# EAGLE design MYC_Homematic_FS20 (EAGLE 7.3.0)
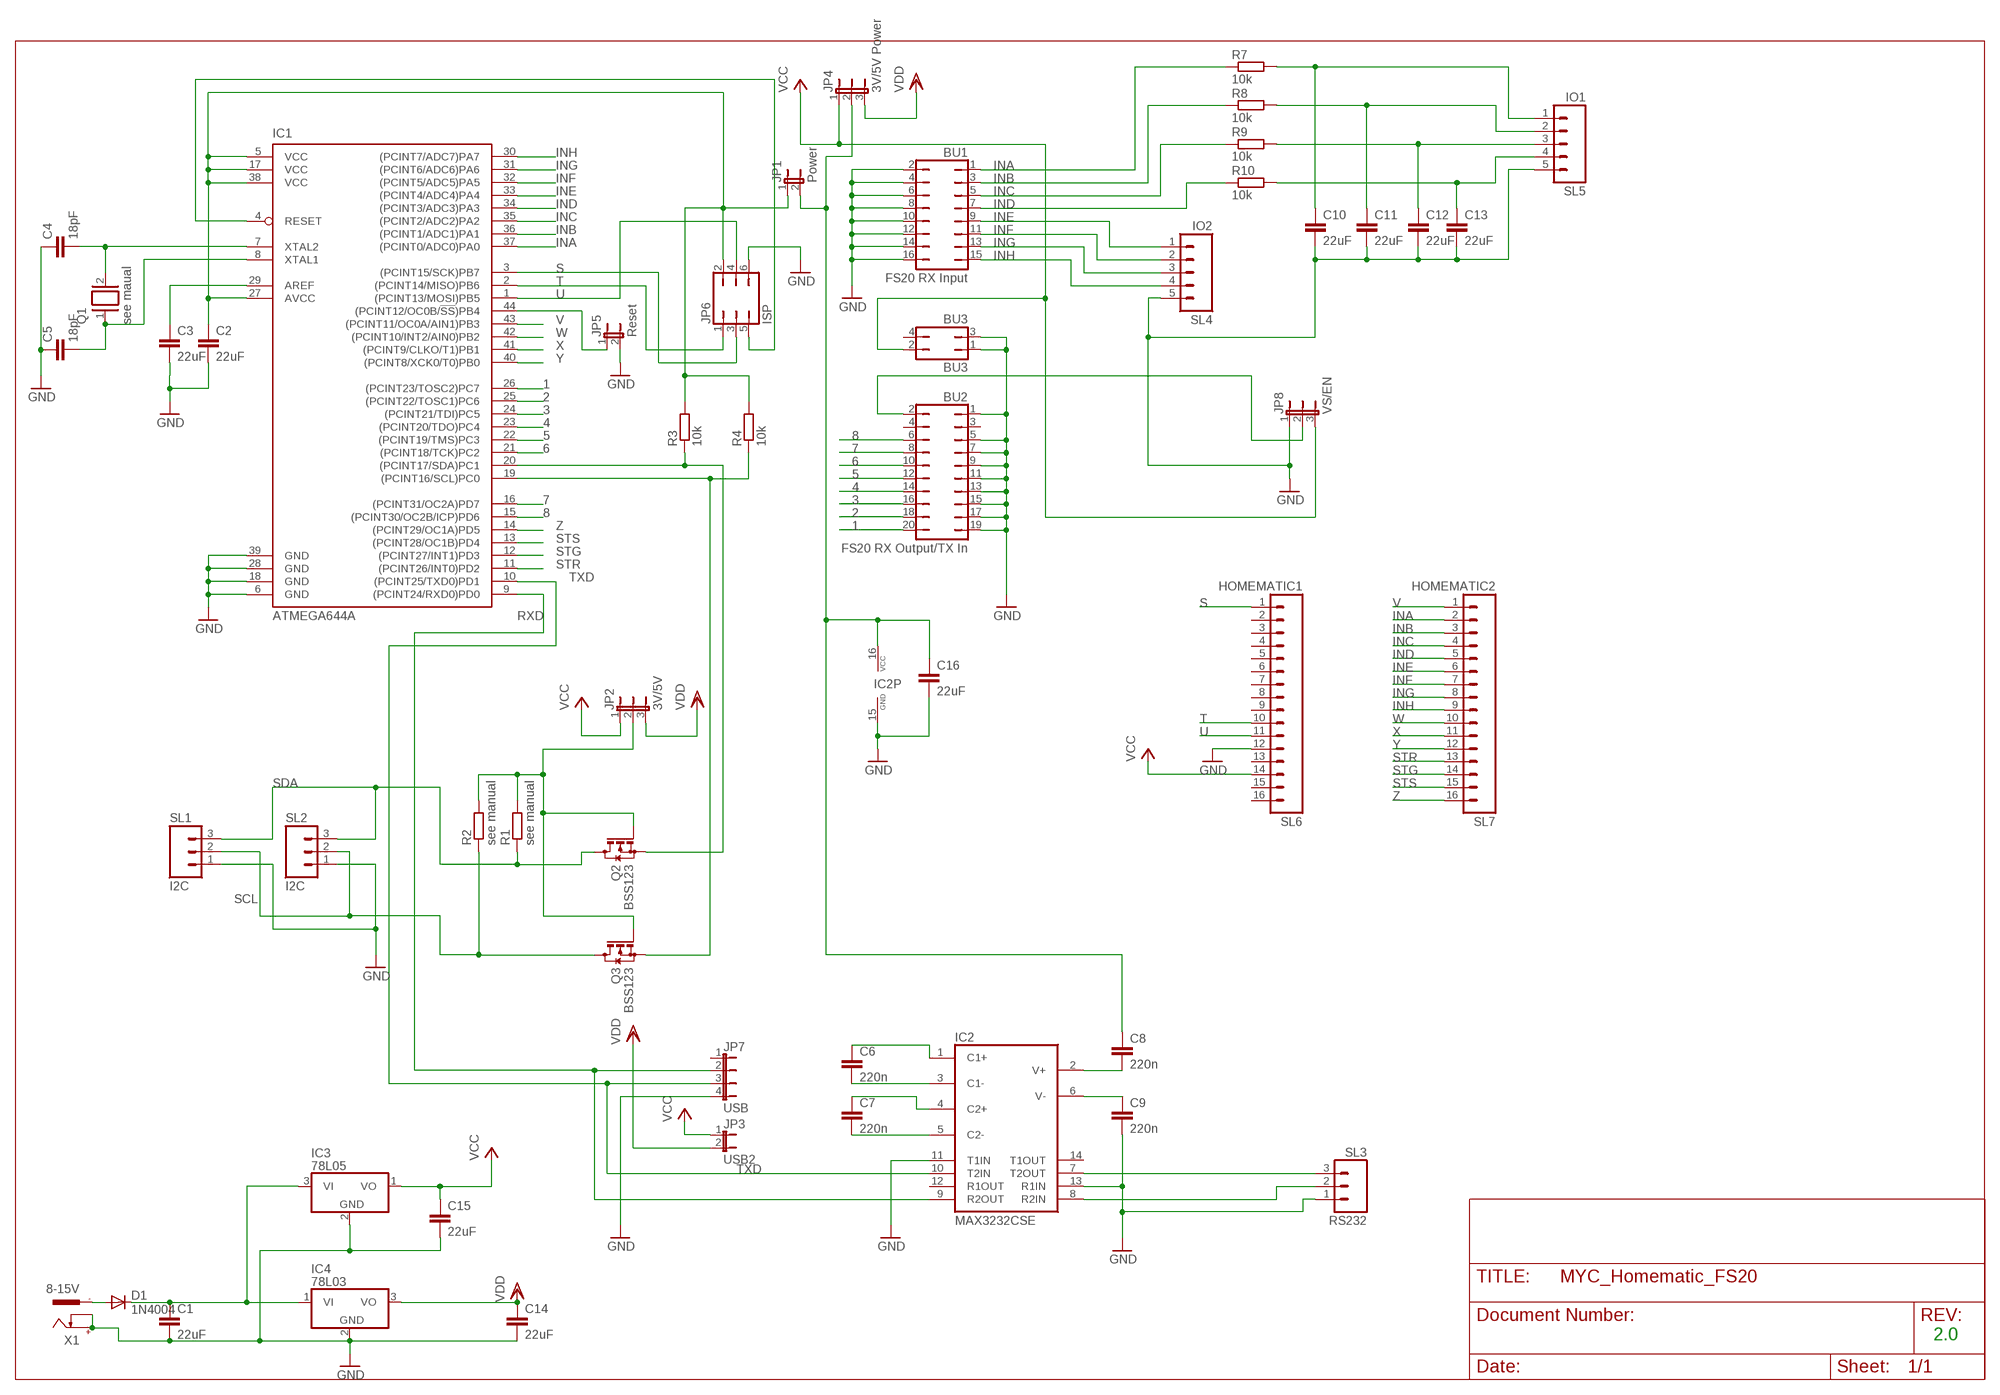
[diagram p0: schematic, sheet 1]

## Parts
BU1  FS20 RX Input  JP8Q  [JP8Q]
BU2  FS20 RX Output/TX In  JP10Q  [JP10Q]
BU3  BU3  JP2Q  [JP2Q]
C1  22uF  C-EUC1206  [C1206]
C2  22uF  C-EUC1206  [C1206]
C3  22uF  C-EUC1206  [C1206]
C4  18pF  C-EU025-030X050  [C025-030X050]
C5  18pF  C-EU025-030X050  [C025-030X050]
C6  220n  C-EUC1206  [C1206]
C7  220n  C-EUC1206  [C1206]
C8  220n  C-EUC1206  [C1206]
C9  220n  C-EUC1206  [C1206]
C10  22uF  C-EUC1206  [C1206]
C11  22uF  C-EUC1206  [C1206]
C12  22uF  C-EUC1206  [C1206]
C13  22uF  C-EUC1206  [C1206]
C14  22uF  C-EUC1206  [C1206]
C15  22uF  C-EUC1206  [C1206]
C16  22uF  C-EUC1206  [C1206]
D1  1N4004  [DO41-10]
IC1  ATMEGA644A  [TQFP44]
IC2  MAX3232CSE  [SO16]
IC3  78L05  7805L  [TO92]
IC4  78L03  7805TV  [TO220V]
JP1  Power  JP1E  [JP1]
JP2  3V/5V  JP2E  [JP2]
JP3  USB2  JP1E  [JP1]
JP4  3V/5V Power  JP2E  [JP2]
JP5  Reset  JP1E  [JP1]
JP6  ISP  JP3Q  [JP3Q]
JP7  USB  JP4E  [JP4]
JP8  VS/EN  JP2E  [JP2]
Q1  see maual  XTAL/S  [QS]
Q2  BSS123  [SOT23]
Q3  BSS123  [SOT23]
R1  see manual  R-EU_R1206  [R1206]
R2  see manual  R-EU_R1206  [R1206]
R3  10k  R-EU_R1206  [R1206]
R4  10k  R-EU_R1206  [R1206]
R7  10k  R-EU_R1206  [R1206]
R8  10k  R-EU_R1206  [R1206]
R9  10k  R-EU_R1206  [R1206]
R10  10k  R-EU_R1206  [R1206]
SL1  I2C  M03  [03P]
SL2  I2C  M03  [03P]
SL3  RS232  M03  [03P]
SL4  IO2  M05  [05P]
SL5  IO1  M05  [05P]
SL6  HOMEMATIC1  M16  [16P]
SL7  HOMEMATIC2  M16  [16P]
X1  8-15V  737992-55  [737992-5]

## Nets
1: BU2.20 IC1.26((PCINT23/TOSC2)PC7)
2: BU2.18 IC1.25((PCINT22/TOSC1)PC6)
3: BU2.16 IC1.24((PCINT21/TDI)PC5)
4: BU2.14 IC1.23((PCINT20/TDO)PC4)
5: BU2.12 IC1.22((PCINT19/TMS)PC3)
6: BU2.10 IC1.21((PCINT18/TCK)PC2)
7: BU2.8 IC1.16((PCINT31/OC2A)PD7)
8: BU2.6 IC1.15((PCINT30/OC2B/ICP)PD6)
C13: C6.1 IC2.1(C1+)
GND: BU1.2 BU1.4 BU1.6 BU1.8 BU1.10 BU1.12 BU1.14 BU1.16 BU2.1 BU2.5 BU2.7 BU2.9 BU2.11 BU2.13 BU2.15 BU2.17 BU2.19 BU3.1 BU3.3 C1.2 C2.2 C3.2 C4.1 C5.1 C9.2 C10.2 C11.2 C12.2 C13.2 C14.2 C15.2 C16.2 IC1.6(GND) IC1.18(GND) IC1.28(GND) IC1.39(GND) IC2.11(T1IN) IC2.13(R1IN) IC2.15(GND) IC3.2(GND) IC4.2(GND) JP5.2 JP6.6 JP7.4 JP8.1 SL1.1 SL2.1 SL3.1 SL4.5 SL5.5 SL6.12 X1.+ X1.K
INA: BU1.1 IC1.37((PCINT0/ADC0)PA0) R7.1 SL7.2
INB: BU1.3 IC1.36((PCINT1/ADC1)PA1) R8.1 SL7.3
INC: BU1.5 IC1.35((PCINT2/ADC2)PA2) R9.1 SL7.4
IND: BU1.7 IC1.34((PCINT3/ADC3)PA3) R10.1 SL7.5
INE: BU1.9 IC1.33((PCINT4/ADC4)PA4) SL4.1 SL7.6
INF: BU1.11 IC1.32((PCINT5/ADC5)PA5) SL4.2 SL7.7
ING: BU1.13 IC1.31((PCINT6/ADC6)PA6) SL4.3 SL7.8
INH: BU1.15 IC1.30((PCINT7/ADC7)PA7) SL4.4 SL7.9
N$1: C1.1 D1.C IC3.3(VI) IC4.1(VI)
N$2: IC1.44((PCINT12/OC0B/!SS!)PB4) JP5.1
N$3: C7.2 IC2.5(C2-)
N$4: JP2.2 Q2.1(G) Q3.1(G) R1.2 R2.2
N$5: IC1.19((PCINT16/SCL)PC0) Q3.2(S) R4.1
N$6: C3.1 IC1.29(AREF)
N$7: C2.1 IC1.5(VCC) IC1.17(VCC) IC1.27(AVCC) IC1.38(VCC) JP1.1 JP6.2 R3.2 R4.2
N$8: IC1.20((PCINT17/SDA)PC1) Q2.2(S) R3.1
N$9: BU2.2 JP8.2
N$10: D1.A X1.-1
N$11: IC2.8(R2IN) SL3.2
N$13: C7.1 IC2.4(C2+)
N$14: C6.2 IC2.3(C1-)
N$15: C10.1 R7.2 SL5.1
N$16: C8.2 IC2.2(V+)
N$17: C9.1 IC2.6(V-)
N$18: C11.1 R8.2 SL5.2
N$19: C4.2 IC1.7(XTAL2) Q1.2
N$21: C12.1 R9.2 SL5.3
N$22: C13.1 R10.2 SL5.4
N$23: C8.1 C16.1 IC2.16(VCC) JP1.2 JP4.2
N$24: IC1.4(RESET) JP6.5
N$27: IC2.7(T2OUT) SL3.3
N$37: C5.2 IC1.8(XTAL1) Q1.1
RXD: IC1.9((PCINT24/RXD0)PD0) IC2.9(R2OUT) JP7.2
S: IC1.3((PCINT15/SCK)PB7) JP6.3 SL6.1
SCL: Q3.3(D) R2.1 SL1.2 SL2.2
SDA: Q2.3(D) R1.1 SL1.3 SL2.3
STG: IC1.12((PCINT27/INT1)PD3) SL7.14
STR: IC1.11((PCINT26/INT0)PD2) SL7.13
STS: IC1.13((PCINT28/OC1B)PD4) SL7.15
T: IC1.2((PCINT14/MISO)PB6) JP6.1 SL6.10
TXD: IC1.10((PCINT25/TXD0)PD1) IC2.10(T2IN) JP7.3
U: IC1.1((PCINT13/MOSI)PB5) JP6.4 SL6.11
V: IC1.43((PCINT11/OC0A/AIN1)PB3) SL7.1
VCC: BU3.2 C15.1 IC3.1(VO) JP2.1 JP3.1 JP4.1 JP8.3 SL6.14
VDD: C14.1 IC4.3(VO) JP2.3 JP3.2 JP4.3
W: IC1.42((PCINT10/INT2/AIN0)PB2) SL7.10
X: IC1.41((PCINT9/CLKO/T1)PB1) SL7.11
Y: IC1.40((PCINT8/XCK0/T0)PB0) SL7.12
Z: IC1.14((PCINT29/OC1A)PD5) SL7.16
Unconnected: BU2.3 BU2.4 BU3.4 IC2.12(R1OUT) IC2.14(T1OUT) JP7.1 SL6.2 SL6.3 SL6.4 SL6.5 SL6.6 SL6.7 SL6.8 SL6.9 SL6.13 SL6.15 SL6.16 X1.-2

## Notes on the sheet
- 2.0

## Library data of the parts
BU1 = jumper:JP8Q: JUMPER
BU2 = jumper:JP10Q: JUMPER
BU3 = jumper:JP2Q: JUMPER
C1-C16 = resistor:C-EU: CAPACITOR, European symbol
D1 = diode:1N4004: DIODE general purpose rectifier, 1 A
IC1 = atmel:ATMEGA644: 8-bit Microcontroller with 64K Bytes In-System Programmable Flash Source: http://www.atmel.com/dyn/resources/prod_documents/doc2593.pdf; MPN: ATMEGA644PV-10AU; OC_FARNELL: 1455123; OC_NEWARK: 58M3748
IC2 = maxim:MAX3232*: True RS-232 Transceivers 3.0V to 5.5V, Low-Power up to 1Mbps, Using Four 0.1µF External Capacitors Source: http://pdfserv.maxim-ic.com/en/ds/MAX3222-MAX3241.pdf; MPN: MAX3232CSE; OC_FARNELL: 9725490; OC_NEWARK: 90C2890
IC3 IC4 = linear:78*: Positive VOLTAGE REGULATOR Source: http://cache.national.com/ds/LM/LM78L05.pdf http://www.fairchildsemi.com/ds/LM/LM7805.pdf
JP1 JP3 JP5 = jumper:JP1E: JUMPER
JP2 JP4 JP8 = jumper:JP2E: JUMPER
JP6 = jumper:JP3Q: JUMPER
JP7 = jumper:JP4E: JUMPER
Q1 = special:XTAL/S: CRYSTAL
Q2 Q3 = transistor-small-signal:BSS123: N-CHANNEL MOS FET
R1-R4 R7-R10 = resistor:R-EU_: RESISTOR, European symbol
SL1-SL3 = con-amp-quick:M03: AMP QUICK CONNECTOR; OC_FARNELL: unknown; OC_NEWARK: unknown
SL4 SL5 = con-amp-quick:M05: AMP QUICK CONNECTOR; OC_FARNELL: unknown; OC_NEWARK: unknown
SL6 SL7 = con-amp-quick:M16: AMP QUICK CONNECTOR; OC_FARNELL: unknown; OC_NEWARK: unknown
X1 = con-conrad:737992-55: FEMALE PRINT CONNECTOR DIN 45323 (34V/3A), ROKA, distributor Conrad

## Board
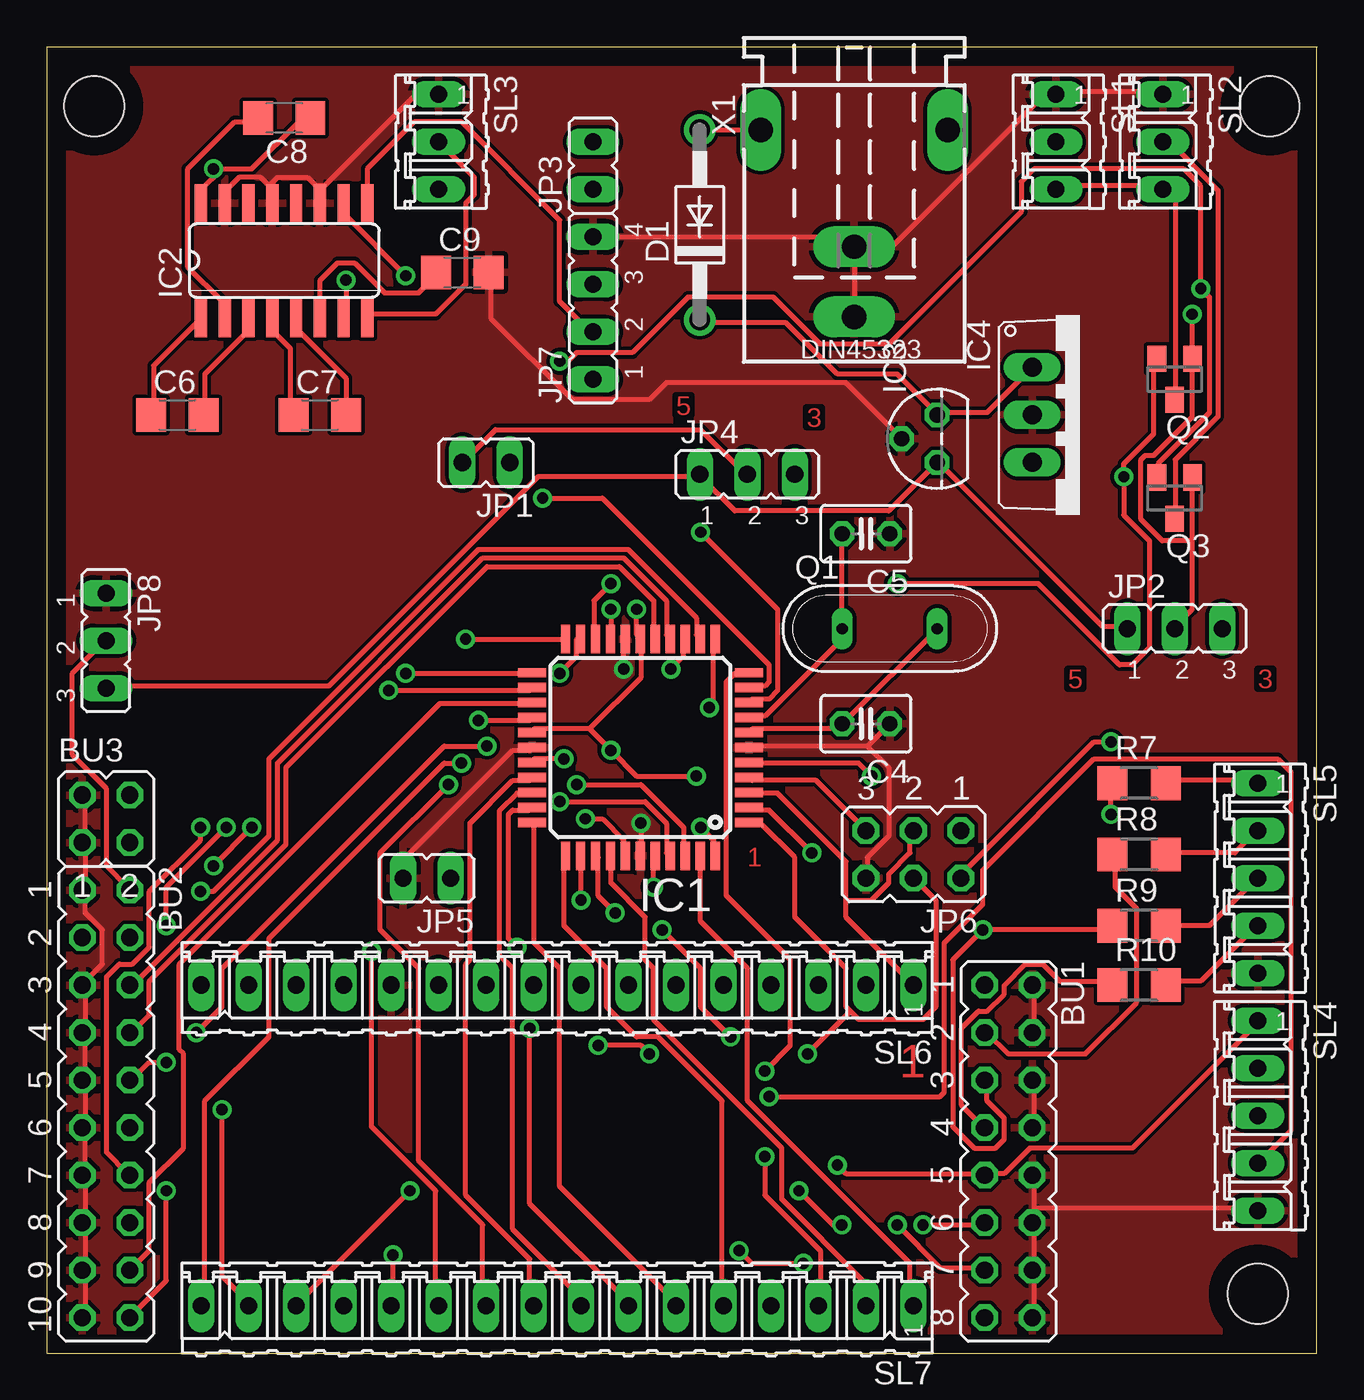
[diagram p1: board, top side]
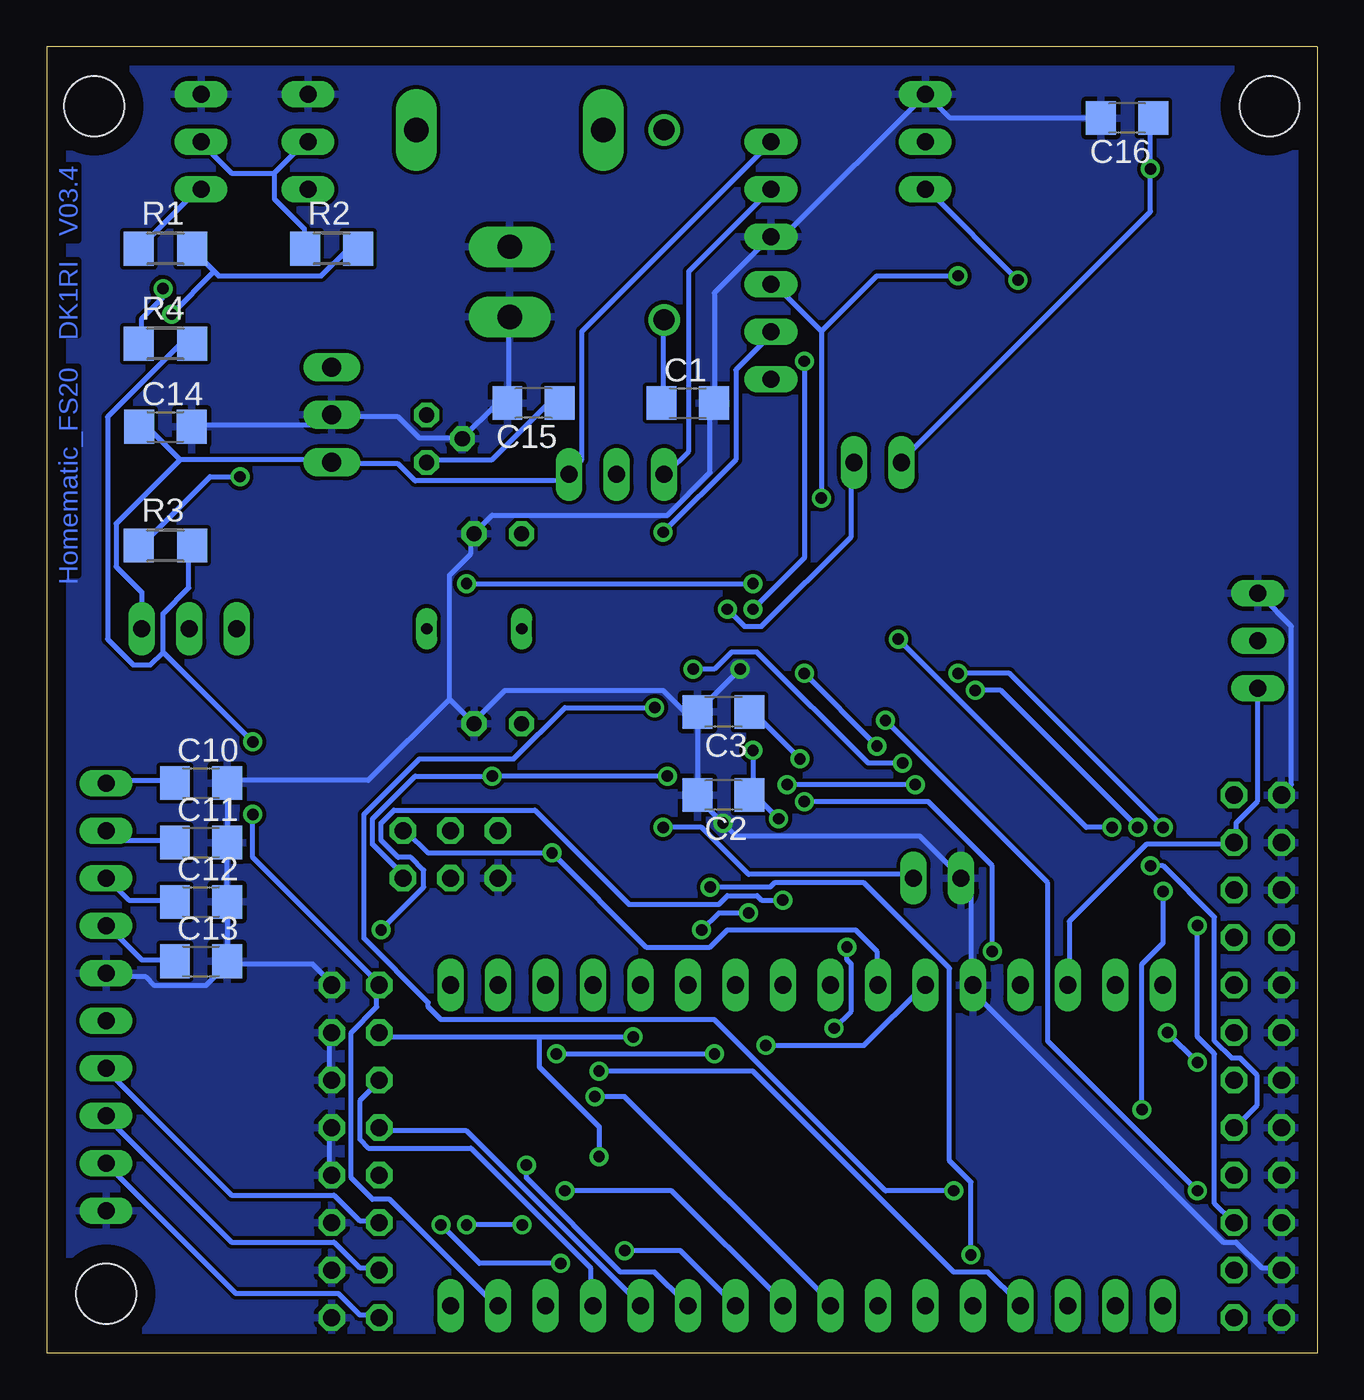
[diagram p2: board, bottom side, seen from below]

Size 67.94 x 69.85 mm. Coordinates in mm from the lower left corner, seen from the top.
Outline: 67.92,69.84 67.92,0 0,0 0,69.85 67.94,69.85
Copper layers (1*16): Top 0.035mm / dielectric 1.5mm / Bottom 0.035mm
Design rules "default": minimum track width 10mil, minimum drill 24mil, track to track 8mil, track to pad 8mil, pad to pad 8mil, via to via 8mil, smd to smd 8mil, copper to edge 40mil, drill to drill 8mil, minimum pad ring 10mil, minimum via ring 8mil, stop-mask expansion 4mil, vias tented up to drill 0mil, thermal gap 10mil
Holes 3.2 mm at 65.41,66.67 64.77,3.17 2.54,66.67

### Footprints (pad centres in the part's own frame; a part is rotated, then mirrored left to right if it is on the bottom)
JP8Q = drill 0.914 octagon: 1 -8.89,-1.27; 2 -8.89,1.27; 3 -6.35,-1.27; 4 -6.35,1.27; 5 -3.81,-1.27; 6 -3.81,1.27; 7 -1.27,-1.27; 8 -1.27,1.27; 9 1.27,-1.27; 10 1.27,1.27; 11 3.81,-1.27; 12 3.81,1.27; 13 6.35,-1.27; 14 6.35,1.27; 15 8.89,-1.27; 16 8.89,1.27
JP10Q = drill 0.914 octagon: 1 -11.43,-1.27; 2 -11.43,1.27; 3 -8.89,-1.27; 4 -8.89,1.27; 5 -6.35,-1.27; 6 -6.35,1.27; 7 -3.81,-1.27; 8 -3.81,1.27; 9 -1.27,-1.27; 10 -1.27,1.27; 11 1.27,-1.27; 12 1.27,1.27; 13 3.81,-1.27; 14 3.81,1.27; 15 6.35,-1.27; 16 6.35,1.27; 17 8.89,-1.27; 18 8.89,1.27; 19 11.43,-1.27; 20 11.43,1.27
JP2Q = drill 0.914 octagon: 1 -1.27,-1.27; 2 1.27,-1.27; 3 -1.27,1.27; 4 1.27,1.27
C1206 = smd 1.6 x 1.8: 1 -1.4,0; 2 1.4,0
C025-030X050 = drill 0.813 octagon: 1 -1.27,0; 2 1.27,0
DO41-10 = drill 1.118: A 5.08,0; C -5.08,0
TQFP44 = smd 1.5 x 0.5: 1 -5.8,4; 2 -5.8,3.2; 3 -5.8,2.4; 4 -5.8,1.6; 5 -5.8,0.8; 6 -5.8,0; 7 -5.8,-0.8; 8 -5.8,-1.6; 9 -5.8,-2.4; 10 -5.8,-3.2; 11 -5.8,-4; 23 5.8,-4; 24 5.8,-3.2; 25 5.8,-2.4; 26 5.8,-1.6; 27 5.8,-0.8; 28 5.8,0; 29 5.8,0.8; 30 5.8,1.6; 31 5.8,2.4; 32 5.8,3.2; 33 5.8,4 | smd 0.5 x 1.5: 12 -4,-5.8; 13 -3.2,-5.8; 14 -2.4,-5.8; 15 -1.6,-5.8; 16 -0.8,-5.8; 17 0,-5.8; 18 0.8,-5.8; 19 1.6,-5.8; 20 2.4,-5.8; 21 3.2,-5.8; 22 4,-5.8; 34 4,5.8; 35 3.2,5.8; 36 2.4,5.8; 37 1.6,5.8; 38 0.8,5.8; 39 0,5.8; 40 -0.8,5.8; 41 -1.6,5.8; 42 -2.4,5.8; 43 -3.2,5.8; 44 -4,5.8
SO16 = smd 0.66 x 2.032: 1 -4.445,-3.073; 2 -3.175,-3.073; 3 -1.905,-3.073; 4 -0.635,-3.073; 5 0.635,-3.073; 6 1.905,-3.073; 7 3.175,-3.073; 8 4.445,-3.073; 9 4.445,3.073; 10 3.175,3.073; 11 1.905,3.073; 12 0.635,3.073; 13 -0.635,3.073; 14 -1.905,3.073; 15 -3.175,3.073; 16 -4.445,3.073
TO92 = drill 0.813 octagon: 1 -1.27,0; 2 0,1.905; 3 1.27,0
TO220V = drill 1.016 long: 1 -2.54,-2.54; 2 0,-2.54; 3 2.54,-2.54
JP1 = drill 0.914 long: 1 0,-1.27; 2 0,1.27
JP2 = drill 0.914 long: 1 -2.54,0; 2 0,0; 3 2.54,0
JP3Q = drill 0.914 octagon: 1 -2.54,-1.27; 2 -2.54,1.27; 3 0,-1.27; 4 0,1.27; 5 2.54,-1.27; 6 2.54,1.27
JP4 = drill 0.914 long: 1 -3.81,0; 2 -1.27,0; 3 1.27,0; 4 3.81,0
QS = drill 0.61 long: 1 -2.54,0; 2 2.54,0
SOT23 = smd 1 x 1.4: 1 -0.95,-1.1; 2 0.95,-1.1; 3 0,1.1
R1206 = smd 1.6 x 1.803: 1 -1.422,0; 2 1.422,0
03P = drill 0.914 long: 1 -2.54,0; 2 0,0; 3 2.54,0
05P = drill 0.914 long: 1 -5.08,0; 2 -2.54,0; 3 0,0; 4 2.54,0; 5 5.08,0
16P = drill 0.914 long: 1 -19.05,0; 2 -16.51,0; 3 -13.97,0; 4 -11.43,0; 5 -8.89,0; 6 -6.35,0; 7 -3.81,0; 8 -1.27,0; 9 1.27,0; 10 3.81,0; 11 6.35,0; 12 8.89,0; 13 11.43,0; 14 13.97,0; 15 16.51,0; 16 19.05,0
737992-5 = drill 1.3 pad 2.184 long: + 0,10; -1 5,0; -2 -5,0; K 0,6.25

### Placement (x,y rotation side)
BU1  51.44,10.79 270 top
BU2  3.17,13.34 270 top
BU3  3.17,28.57 0 top
C1  33.66,50.8 0 bottom
C2  31.75,29.84 180 bottom
C3  31.75,34.29 180 bottom
C4  43.81,33.66 180 top
C5  43.81,43.81 180 top
C6  6.99,50.16 0 top
C7  14.61,50.16 0 top
C8  12.7,66.04 180 top
C9  22.23,57.78 0 top
C10  59.69,30.48 0 bottom
C11  59.69,27.3 0 bottom
C12  59.69,24.13 0 bottom
C13  59.69,20.95 0 bottom
C14  61.59,49.53 0 bottom
C15  41.91,50.8 180 bottom
C16  10.16,66.04 180 bottom
D1  34.92,60.33 90 top
IC1  31.75,32.38 180 top
IC2  12.7,58.42 0 top
IC3  47.62,48.9 90 top
IC4  55.24,50.16 270 top
JP1  23.5,47.62 90 top
JP2  60.33,38.73 0 top
JP3  29.21,63.5 0 top
JP4  37.47,46.99 0 top
JP5  20.32,25.4 90 top
JP6  46.35,26.67 180 top
JP7  29.21,55.88 90 top
JP8  3.17,38.1 270 top
Q1  45.09,38.73 0 top
Q2  60.33,52.07 180 top
Q3  60.33,45.72 180 top
R1  61.59,59.05 0 bottom
R2  52.7,59.05 0 bottom
R3  61.59,43.18 0 bottom
R4  61.59,53.98 0 bottom
R7  58.42,30.48 0 top
R8  58.42,26.67 0 top
R9  58.42,22.86 0 top
R10  58.42,19.68 0 top
SL1  53.98,64.77 270 top
SL2  59.69,64.77 270 top
SL3  20.95,64.77 270 top
SL4  64.77,12.7 270 top
SL5  64.77,25.4 270 top
SL6  27.3,19.68 180 top
SL7  27.3,2.54 180 top
X1  43.18,65.41 180 top

### Tracks (layer width: path | path; a pad name or v marks a point on that pad's centre or on a via)
1  (via drill 0.61)
  Top 0.254: v23.09,33.83 25.83,33.83 IC1.26 | v6.4,8.69 6.4,3.89 4.57,2.06 BU2.20
  Bottom 0.254: v23.09,33.83 14.4,25.15 14.4,16.69 v6.4,8.69
2
  Top 0.254: BU2.18 5.49,5.49 5.49,9.14 7.32,10.97 7.32,16 7.09,16.23 7.09,20.8 21.03,34.75 25.83,34.75 IC1.25
3  (via drill 0.61)
  Top 0.254: v18.29,35.43 25.83,35.43 IC1.24 | v9.6,28.12 6.4,24.92 v6.4,22.86
  Bottom 0.254: v18.29,35.43 16.92,35.43 v9.6,28.12 | v6.4,22.86 6.4,16.92 5.49,16 5.49,8 4.57,7.09 BU2.16
4  (via drill 0.61)
  Top 0.254: v19.2,36.35 25.83,36.35 IC1.23 | v8.23,28.12 8.23,27.43 5.49,24.69 5.49,21.72 4.57,20.8 3.89,20.8 3.2,20.12 3.2,10.74 4.34,9.6 BU2.14
  Bottom 0.254: v19.2,36.35 16.46,36.35 v8.23,28.12
5  (via drill 0.61)
  Top 0.254: v22.4,38.18 27.66,38.18 IC1.22 | v8.91,26.06 v10.97,28.12
  Bottom 0.254: v22.4,38.18 12.34,28.12 v10.97,28.12 | v8.91,26.06 8.23,26.06 5.49,23.32 5.49,16.69 4.57,15.77 4.12,15.77 3.2,14.86 3.2,13.26 4.34,12.12 BU2.12
6  (via drill 0.61)
  Top 0.254: v27.43,36.35 28.35,37.26 28.35,38.18 IC1.21 | v23.55,32.46 21.26,32.46 9.37,20.57 9.37,18.52 v8,17.14 | v6.4,15.54 5.49,15.54 4.57,14.63 BU2.10
  Bottom 0.254: v23.55,32.46 v27.43,36.35 | v6.4,15.54 v8,17.14
7
  Top 0.254: IC1.16 32.46,38.41 32.46,40.23 30.63,42.06 23.55,42.06 12.8,31.32 12.8,27.2 5.49,19.89 5.49,18.06 4.57,17.14 BU2.8
8
  Top 0.254: IC1.15 33.15,38.41 33.15,40.23 30.86,42.52 23.32,42.52 12.34,31.55 12.34,27.43 4.57,19.66 BU2.6
C13
  Top 0.254: IC2.1 5.71,52.81 5.71,50.29 C6.1
GND  (via drill 0.61)
  Top 0.254: 11.89,62.41 11.43,62.87 10.29,62.87 9.6,62.18 9.6,61.49 IC2.15 | 11.89,62.41 11.89,61.49 IC2.13 11.89,62.41 | 14.4,62.41 14.4,61.49 IC2.11 14.4,62.41 | 14.4,62.41 13.95,62.87 12.34,62.87 11.89,62.41 | 14.4,62.41 14.86,62.41 19.66,67.21 20.8,67.21 SL3.1 | SL2.1 59.66,67.44 54.18,67.44 SL1.1 53.95,67.21 53.26,67.21 45.26,59.21 43.2,59.21 X1.K | X1.+ 43.2,55.55 43.2,58.98 X1.K | C9.2 23.77,57.61 23.77,55.32 28.12,50.98 32.23,50.98 33.15,51.89 42.75,51.89 45.72,48.92 IC3.2 | JP7.4 29.26,59.66 42.52,59.66 42.98,59.21 X1.K | BU3.3 2.06,29.72 2.06,27.43 BU3.1 2.06,27.2 2.06,24.92 BU2.1 2.06,24.69 2.06,23.55 2.97,22.63 2.97,20.8 2.06,19.89 BU2.5 2.06,19.66 2.06,17.14 | BU2.19 2.06,2.06 2.06,4.34 BU2.17 2.06,4.57 2.06,6.86 BU2.15 2.06,7.09 2.06,9.37 BU2.13 2.06,9.6 2.06,11.89 BU2.11 2.06,12.12 2.06,14.4 BU2.9 2.06,14.63 2.06,17.14 | 2.06,17.14 BU2.7 | BU1.4 52.81,17.14 52.81,19.66 BU1.2 | BU1.8 52.81,12.12 52.81,14.4 BU1.6 | BU1.16 52.81,2.06 52.81,4.34 BU1.14 52.81,4.57 52.81,6.86 BU1.12 52.81,7.09 52.81,7.77 | 52.81,7.77 52.81,9.37 BU1.10 | 52.81,7.77 64.69,7.77 SL4.5 | IC1.28 25.83,32.23 24.92,32.23 19.2,26.52 19.2,25.6 JP5.2 | v31.77,28.35 31.77,26.75 IC1.39 | v30.86,36.58 30.86,38.18 IC1.18 | 43.89,32.46 37.72,32.46 IC1.6 | C4.1 43.89,32.46 | 43.89,32.46 45.03,31.32 45.03,27.66 43.89,26.52 43.89,25.6 JP6.6
  Bottom 0.254: C16.2 11.66,66.06 19.66,66.06 20.8,67.21 SL3.1 21.03,67.21 28.35,59.89 29.03,59.89 JP7.4 29.26,59.66 32.23,56.69 32.23,50.98 C1.2 32.46,50.75 32.46,47.09 34.75,44.81 44.12,44.81 45.03,43.89 C5.1 45.26,43.66 45.26,42.75 46.41,41.6 46.41,34.98 | C14.2 60.12,49.61 53.26,49.61 IC4.2 52.58,50.06 49.15,50.06 48.01,48.92 45.72,48.92 | 45.72,48.92 43.89,50.75 43.43,50.75 C15.2 43.2,50.98 43.2,55.32 X1.+ | 45.72,48.92 IC3.2 | JP8.1 2.97,40.46 1.37,38.86 1.37,30.4 1.83,29.95 BU3.3 | C13.2 58.29,21.03 58.29,24 C12.2 58.29,24.23 58.29,27.2 C11.2 58.29,27.43 58.29,30.4 C10.2 58.06,30.63 50.75,30.63 46.41,34.98 | SL5.5 64.69,20.12 62.64,20.12 62.18,19.66 59.44,19.66 58.29,20.8 C13.2 | BU1.8 52.81,11.89 52.81,9.6 BU1.10 | BU1.4 52.81,17.14 52.81,14.63 BU1.6 | C13.2 58.06,20.8 53.72,20.8 52.81,19.89 BU1.2 | C3.2 v30.86,36.58 | C3.2 33.15,29.95 C2.2 33.15,29.72 v31.77,28.35 31.09,27.66 21.26,27.66 19.2,25.6 JP5.2 18.97,25.38 18.52,24.92 18.52,19.89 SL6.12 18.29,19.66 18.29,19.2 5.03,5.94 4.34,5.94 2.97,4.57 2.06,4.57 BU2.17 | C3.2 33.83,34.29 34.98,35.43 43.43,35.43 45.03,33.83 C4.1 46.41,34.98
  pour Top: 0.64,69.22 67.31,69.22 67.31,0.64 0.64,0.64
  pour Bottom: 0.64,69.22 67.31,69.22 67.31,0.64 0.64,0.64
INA  (via drill 0.61)
  Top 0.254: v56.92,28.8 56.92,30.4 R7.1 | IC1.37 30.18,26.52 30.18,25.15 32,23.32 32,21.03 32.46,20.57 32.46,17.83 39.32,10.97 39.32,8.23 43.66,3.89 43.66,2.74 SL7.2
  Bottom 0.254: v56.92,28.8 56.92,26.52 50.29,19.89 BU1.1 50.29,19.66 50.29,18.52 51.66,17.14 51.66,9.37 50.52,8.23 49.61,8.23 43.89,2.52 SL7.2
INB  (via drill 0.61)
  Top 0.254: v30.4,23.55 29.49,24.46 29.49,26.52 IC1.36 | v32.92,22.63 34.98,20.57 34.98,18.52 v36.58,16.92 | R8.1 57.15,26.52 57.15,24.92 58.29,23.77 58.29,18.75 55.55,16 51.44,16 50.29,17.14 BU1.3 | v38.41,10.52 38.41,8.46 41.38,5.49 41.38,2.74 SL7.3
  Bottom 0.254: v30.4,23.55 32,23.55 v32.92,22.63 | 41.6,16.92 49.84,16.92 50.06,17.14 BU1.3 | 41.6,16.92 v36.58,16.92 | v38.41,10.52 38.41,12.12 41.6,15.32 41.6,16.92
INC  (via drill 0.61)
  Top 0.254: v28.57,24.23 28.57,26.52 IC1.35 | R9.1 56.92,22.86 56.69,22.63 v50.06,22.63 48.46,21.03 48.46,12.12 49.61,10.97 50.75,10.97 51.21,11.43 51.21,12.57 50.29,13.49 50.29,14.4 BU1.5
  Bottom 0.254: SL7.4 38.86,2.74 38.86,4.57 45.26,10.97 50.75,10.97 51.21,11.43 51.21,13.49 50.29,14.4 BU1.5 | v28.57,24.23 29.72,24.23 29.95,24.46 31.55,24.46 32,24 36.8,24 41.83,29.03 49.38,29.03 50.06,28.35 50.06,27.43 49.15,26.52 48.46,26.52 47.78,25.83 47.78,24.92 v50.06,22.63
IND
  Top 0.254: R10.1 56.92,19.89 54.18,19.89 53.26,20.8 52.35,20.8 51.21,19.66 51.21,19.2 50.29,18.29 49.84,18.29 48.92,17.37 48.92,13.26 50.06,12.12 BU1.7 | IC1.34 27.66,26.52 27.66,22.86 29.95,20.57 29.95,18.52 31.55,16.92 32.69,16.92 36.12,13.49 36.12,2.74 SL7.5
  Bottom 0.254: BU1.7 50.06,11.89 45.49,11.89 36.35,2.74 SL7.5
INE  (via drill 0.61)
  Top 0.254: SL4.1 64.69,17.6 58.06,10.97 52.58,10.97 51.21,9.6 50.29,9.6 BU1.9 50.06,9.6 42.75,9.6 v42.29,10.06 | IC1.33 26.06,28.35 26.06,21.95 27.43,20.57 27.43,8.91 33.6,2.74 SL7.6
  Bottom 0.254: v42.29,10.06 42.29,9.37 37.26,4.34 35.43,4.34 33.83,2.74 SL7.6
INF  (via drill 0.61)
  Top 0.254: v25.15,21.72 24.69,22.17 24.69,28.8 24.92,29.03 25.83,29.03 IC1.32 | v25.83,17.37 25.83,8 31.09,2.74 SL7.7 | v46.86,6.86 50.06,6.86 BU1.11 | v40.46,4.8 37.72,4.8 v37.03,5.49
  Bottom 0.254: BU1.11 50.29,7.09 51.21,7.09 52.58,8.46 58.06,8.46 64.69,15.09 SL4.2 | v25.15,21.72 25.15,21.03 24.92,20.8 24.92,18.29 v25.83,17.37 | v46.86,6.86 44.81,4.8 v40.46,4.8 | v37.03,5.49 34.06,5.49 SL7.7
ING  (via drill 0.61)
  Top 0.254: SL7.8 28.57,2.97 24.92,6.63 24.92,20.57 24.23,21.26 24.23,29.03 25.15,29.95 25.83,29.95 IC1.31 | v45.49,6.86 47.78,4.57 50.06,4.57 BU1.13 | v42.52,6.86 42.06,6.86 v40.23,8.69
  Bottom 0.254: BU1.13 50.29,4.57 51.21,4.57 52.58,5.94 58.06,5.94 64.69,12.57 SL4.3 | v42.52,6.86 v45.49,6.86 | v40.23,8.69 34.52,8.69 28.57,2.74 SL7.8
INH  (via drill 0.61)
  Top 0.254: IC1.30 25.83,30.63 24.92,30.63 22.63,28.35 22.63,21.03 22.4,20.8 22.4,8.46 25.83,5.03 25.83,2.74 SL7.9 | v38.63,13.72 47.78,13.72 48.01,13.95 48.01,21.95 50.06,24 50.06,25.83 56.01,31.77 65.84,31.77 66.52,31.09 66.52,11.89 64.92,10.29 SL4.4
  Bottom 0.254: BU1.15 50.29,2.06 51.21,2.06 52.35,3.2 57.84,3.2 64.69,10.06 SL4.4 | v38.63,13.72 37.03,13.72 26.06,2.74 SL7.9
N$1
  Top 0.254: IC4.1 50.29,50.29 47.78,50.29 IC3.3 47.55,50.29 45.49,52.35 42.29,52.35 39.55,55.09 34.98,55.09 D1.C
  Bottom 0.254: C1.1 34.98,50.98 34.98,55.09 D1.C
N$2  (via drill 0.61)
  Top 0.254: v34.98,28.12 35.66,27.43 35.66,26.75 IC1.44
  Bottom 0.254: v34.98,28.12 32.92,28.12 30.4,25.6 21.72,25.6 JP5.1
N$3
  Top 0.254: C7.2 16,50.29 16,52.12 13.49,54.63 13.49,55.32 IC2.5
N$4  (via drill 0.61)
  Top 0.254: 61.27,43.43 61.27,39.78 60.35,38.86 JP2.2 | 61.27,43.43 61.27,46.63 Q3.1 | 61.27,43.43 59.66,43.43 58.52,44.58 58.52,47.78 58.75,48.01 59.21,48.01 61.27,50.06 61.27,53.03 Q2.1 61.27,53.26 v61.27,55.55
  Bottom 0.254: 58.98,57.84 60.12,58.98 R1.2 | 58.98,57.84 58.75,57.61 53.26,57.61 51.89,58.98 51.44,58.98 R2.2 | v61.27,55.55 58.98,57.84
N$5  (via drill 0.61)
  Top 0.254: Q3.2 59.44,46.86 59.44,47.55 62.18,50.29 62.18,56.46 v61.72,56.92 61.72,62.41 60.81,63.32 52.81,63.32 52.12,62.64 52.12,61.04 45.03,53.95 41.38,53.95 38.86,56.46 34.29,56.46 31.32,53.49 28.35,53.49 27.89,53.03 v27.43,53.03 | v30.18,39.78 30.18,38.41 IC1.19
  Bottom 0.254: v61.72,56.92 61.72,56.46 62.87,55.32 62.87,54.18 R4.1 | v30.18,39.78 27.43,42.52 v27.43,53.03
N$6  (via drill 0.61)
  Top 0.254: v27.66,31.77 26.06,31.77 IC1.29
  Bottom 0.254: v27.66,31.77 30.18,34.29 C3.1
N$7  (via drill 0.61)
  Top 0.254: v44.12,30.86 43.43,31.55 37.72,31.55 IC1.5 | v28.8,28.57 29.72,28.57 30.86,27.43 30.86,26.75 IC1.38 | 29.03,33.38 26.06,33.38 IC1.27 | 29.03,33.38 31.77,36.12 31.77,38.18 IC1.17 31.55,38.41 v31.55,39.78 | 29.03,33.38 v30.18,32.23 31.55,30.86 v34.75,30.86 | v56.92,32.69 56.01,32.69 48.92,25.6 JP6.2
  Bottom 0.254: 61.72,37.49 61.72,39.55 60.35,40.92 60.35,42.98 R3.2 | 61.72,37.49 62.41,36.8 63.32,36.8 64.69,38.18 64.69,50.06 60.81,53.95 60.35,53.95 R4.2 | JP6.2 48.92,25.6 50.52,27.2 50.52,28.57 48.23,30.86 v44.12,30.86 v34.75,30.86 | 30.18,29.95 v28.8,28.57 | v31.55,39.78 30.63,38.86 29.72,38.86 24.92,43.66 24.92,47.55 JP1.1 | v30.18,32.23 30.18,29.95 | 30.18,29.95 C2.1 | v56.92,32.69 61.72,37.49
N$8  (via drill 0.61)
  Top 0.254: Q2.2 59.21,53.03 59.21,49.15 57.61,47.55 v57.61,46.86 57.61,44.81 58.98,43.43 58.98,37.72 58.06,36.8 57.38,36.8 53.03,41.15 v45.49,41.15 | v30.18,41.15 29.26,40.23 29.26,38.41 IC1.20
  Bottom 0.254: v57.61,46.86 59.21,46.86 62.87,43.2 R3.1 | v45.49,41.15 v30.18,41.15
N$9
  Top 0.254: JP8.2 2.97,37.95 1.37,36.35 1.37,32 3.2,30.18 3.2,26.06 4.34,24.92 BU2.2
N$10
  Top 0.254: D1.A 34.98,65.38 38.18,65.38 X1.-1
N$11
  Top 0.254: SL3.2 22.86,62.87 22.86,61.95 22.4,61.49 22.4,57.15 20.8,55.55 17.14,55.55 IC2.8
N$13
  Top 0.254: C7.1 13.03,50.29 13.03,53.72 12.12,54.63 12.12,55.32 IC2.4
N$14
  Top 0.254: C6.2 8.46,50.29 8.46,52.35 10.74,54.63 10.74,55.32 IC2.3
N$15
  Top 0.254: R7.2 59.89,30.63 64.69,30.63 SL5.1
  Bottom 0.254: C10.1 61.27,30.63 64.69,30.63 SL5.1
N$16
  Top 0.254: C8.2 11.2,65.84 10.06,65.84 7.54,63.32 7.54,58.06 9.37,56.24 9.37,55.55 IC2.2
N$17
  Top 0.254: C9.1 20.8,57.61 19.89,56.69 18.06,56.69 16.46,58.29 15.54,58.29 14.63,57.38 14.63,55.55 IC2.6
N$18
  Top 0.254: R8.2 59.89,26.75 63.55,26.75 64.69,27.89 SL5.2
  Bottom 0.254: C11.1 61.27,27.43 64.24,27.43 64.69,27.89 SL5.2
N$19
  Top 0.254: IC1.7 37.72,33.38 42.29,33.38 42.52,33.6 C4.2 42.75,33.83 47.55,38.63 Q1.2
N$21
  Top 0.254: R9.2 62.18,22.86 64.69,25.38 SL5.3
  Bottom 0.254: C12.1 61.27,24.23 63.55,24.23 64.69,25.38 SL5.3
N$22
  Top 0.254: R10.2 59.89,19.89 61.72,19.89 64.69,22.86 SL5.4
  Bottom 0.254: C13.1 61.27,21.03 62.87,21.03 64.69,22.86 SL5.4
N$23  (via drill 0.61)
  Top 0.254: 9.14,63.09 8.46,62.41 8.46,61.49 IC2.16 | 9.14,63.09 9.37,63.32 10.97,63.32 13.49,65.84 13.95,65.84 C8.1 | JP4.2 37.26,47.09 34.98,49.38 24,49.38 22.4,47.78 JP1.2 | v8.91,63.32 9.14,63.09
  Bottom 0.254: C16.1 8.91,65.84 v8.91,63.32 8.91,61.04 22.17,47.78 JP1.2
N$24
  Top 0.254: IC1.4 37.72,30.63 41.15,30.63 43.66,28.12 JP6.5
N$27  (via drill 0.61)
  Top 0.254: v16,57.38 16,55.55 IC2.7
  Bottom 0.254: v16,57.38 20.8,62.18 SL3.3
N$37
  Top 0.254: IC1.8 37.72,34.06 38.41,34.06 42.52,38.18 42.52,38.63 Q1.1 42.52,38.86 42.52,43.66 C5.2
RXD  (via drill 0.61)
  Top 0.254: v34.98,43.89 39.09,39.78 39.09,35.43 38.63,34.98 37.72,34.98 IC1.9 | IC2.9 17.14,63.32 19.66,65.84 22.17,65.84 27.43,60.58 27.43,56.24 29.03,54.63 JP7.2
  Bottom 0.254: v34.98,43.89 31.09,47.78 31.09,52.58 29.26,54.41 JP7.2
S
  Top 0.254: 42.75,24.23 42.75,23.32 46.18,19.89 SL6.1 | 42.75,24.23 42.75,26.29 39.09,29.95 37.72,29.95 IC1.3 | 42.75,24.23 44.12,24.23 45.03,25.15 45.03,25.6 46.18,26.75 46.18,27.89 JP6.3
SCL
  Top 0.254: Q3.3 60.35,44.81 60.35,47.78 62.64,50.06 62.64,62.18 59.89,64.92 SL2.2
  Bottom 0.254: 55.78,63.09 55.78,61.72 54.18,60.12 54.18,59.21 R2.1 | 55.78,63.09 54.18,64.69 SL1.2 | 55.78,63.09 58.06,63.09 59.66,64.69 SL2.2
SDA
  Top 0.254: Q2.3 60.35,50.98 60.35,61.72 59.89,62.18 SL2.3 59.66,62.41 54.18,62.41 SL1.3
  Bottom 0.254: R1.1 62.87,59.21 59.89,62.18 SL2.3
STG  (via drill 0.61)
  Top 0.254: v35.43,34.52 35.66,34.75 35.66,38.18 IC1.12 | v19.43,8.69 13.49,2.74 SL7.14
  Bottom 0.254: v35.43,34.52 40.23,34.52 42.98,31.77 48.01,31.77 50.98,28.8 50.98,22.17 47.55,18.75 47.55,18.52 46.86,17.83 32.23,17.83 23.09,8.69 v19.43,8.69
STR  (via drill 0.61)
  Top 0.254: v38.41,15.09 39.78,16.46 39.78,21.03 36.35,24.46 36.35,35.89 36.8,36.35 37.49,36.35 IC1.11
  Bottom 0.254: v38.41,15.09 30.18,15.09 19.43,4.34 17.6,4.34 16,2.74 SL7.13
STS  (via drill 0.61)
  Top 0.254: v8.23,24.69 8.91,24.69 11.89,27.66 11.89,31.77 23.09,42.98 31.09,42.98 34.75,39.32 34.75,38.41 IC1.13 | v9.37,13.03 9.37,4.12 10.74,2.74 SL7.15
  Bottom 0.254: v8.23,24.69 8.23,21.95 9.37,20.8 v9.37,13.03
T  (via drill 0.61)
  Top 0.254: v40.92,26.75 38.63,29.03 37.72,29.03 IC1.2
  Bottom 0.254: JP6.1 48.69,27.89 47.55,26.75 v40.92,26.75 35.89,21.72 32.46,21.72 31.55,22.63 24.69,22.63 23.55,21.49 23.55,19.89 SL6.10
TXD  (via drill 0.61)
  Top 0.254: v26.52,45.72 29.72,45.72 38.63,36.8 38.63,35.89 38.41,35.66 37.72,35.66 IC1.10 | v19.2,57.61 16,60.81 16,61.49 IC2.10
  Bottom 0.254: 26.52,54.63 v26.52,45.72 | 26.52,54.63 29.03,57.15 JP7.3 | v19.2,57.61 23.55,57.61 26.52,54.63
U  (via drill 0.61)
  Top 0.254: 42.98,18.29 43.43,17.83 46.86,17.83 47.55,18.52 47.55,24.23 46.41,25.38 JP6.4 | 42.98,18.29 42.75,18.52 42.75,20.57 40.01,23.32 40.01,26.52 38.18,28.35 37.72,28.35 IC1.1 | v29.49,16.46 31.77,16.46 v32.23,16 | 42.98,18.29 v40.69,16
  Bottom 0.254: v29.49,16.46 24.23,16.46 21.03,19.66 SL6.11 | v40.69,16 v32.23,16
V
  Top 0.254: IC1.43 34.98,26.52 34.98,23.09 37.49,20.57 37.49,13.49 46.18,4.8 46.18,2.74 SL7.1
VCC
  Top 0.254: JP2.1 57.61,38.86 56.46,38.86 47.78,47.55 IC3.1 45.03,45.03 36.8,45.03 34.98,46.86 JP4.1 34.75,46.86 26.29,46.86 15.09,35.66 3.2,35.66 JP8.3
  Bottom 0.254: JP8.3 3.2,35.43 3.2,29.49 4.34,28.35 4.34,27.43 BU3.2 4.57,27.2 9.14,27.2 13.26,23.09 13.26,19.89 SL6.14 | C15.1 40.69,50.75 41.15,50.75 44.12,47.78 47.55,47.78 IC3.1 | JP3.1 33.6,57.84 33.6,48.23 34.75,47.09 JP4.1
VDD
  Bottom 0.254: 60.81,47.78 62.41,49.38 62.87,49.38 C14.1 | 60.81,47.78 52.81,47.78 IC4.3 52.58,47.55 49.15,47.55 48.23,46.63 40.23,46.63 40.01,46.86 JP4.3 40.01,47.09 39.32,47.78 39.32,54.63 29.26,64.69 JP3.2 | JP2.3 62.87,40.69 64.24,42.06 64.24,44.35 60.81,47.78
W  (via drill 0.61)
  Top 0.254: v28.35,30.4 31.77,30.4 34.06,28.12 34.06,26.75 IC1.42 | v21.49,30.4 17.83,26.75 17.83,22.63 19.89,20.57 19.89,10.29 23.32,6.86 23.32,2.74 SL7.10
  Bottom 0.254: v21.49,30.4 v28.35,30.4
X  (via drill 0.61)
  Top 0.254: v27.43,29.49 32,29.49 33.15,28.35 33.15,26.75 IC1.41 | v17.37,21.49 17.37,12.12 20.8,8.69 20.8,2.74 SL7.11
  Bottom 0.254: v27.43,29.49 20.8,29.49 17.37,26.06 v17.37,21.49
Y  (via drill 0.61)
  Top 0.254: v32.46,24.92 32.46,26.52 IC1.40 | v18.52,5.26 18.52,2.74 SL7.12
  Bottom 0.254: v32.46,24.92 29.26,24.92 29.03,25.15 24.23,25.15 19.66,20.57 19.66,10.29 18.52,9.14 v18.52,5.26
Z  (via drill 0.61)
  Top 0.254: v33.38,36.58 34.06,37.26 34.06,38.18 IC1.14 | v22.17,31.55 21.26,31.55 11.89,22.17 11.89,16.92 8.46,13.49 8.46,2.74 SL7.16
  Bottom 0.254: v33.38,36.58 32.23,36.58 31.32,37.49 29.95,37.49 24,31.55 v22.17,31.55

### Text on the board
Top: 5 | 3 | 5 | 3 | 1 | 1
Bottom: V03.4 | DK1RI | Homematic_FS20